# EAGLE design saturation.main (EAGLE 9.5.1)
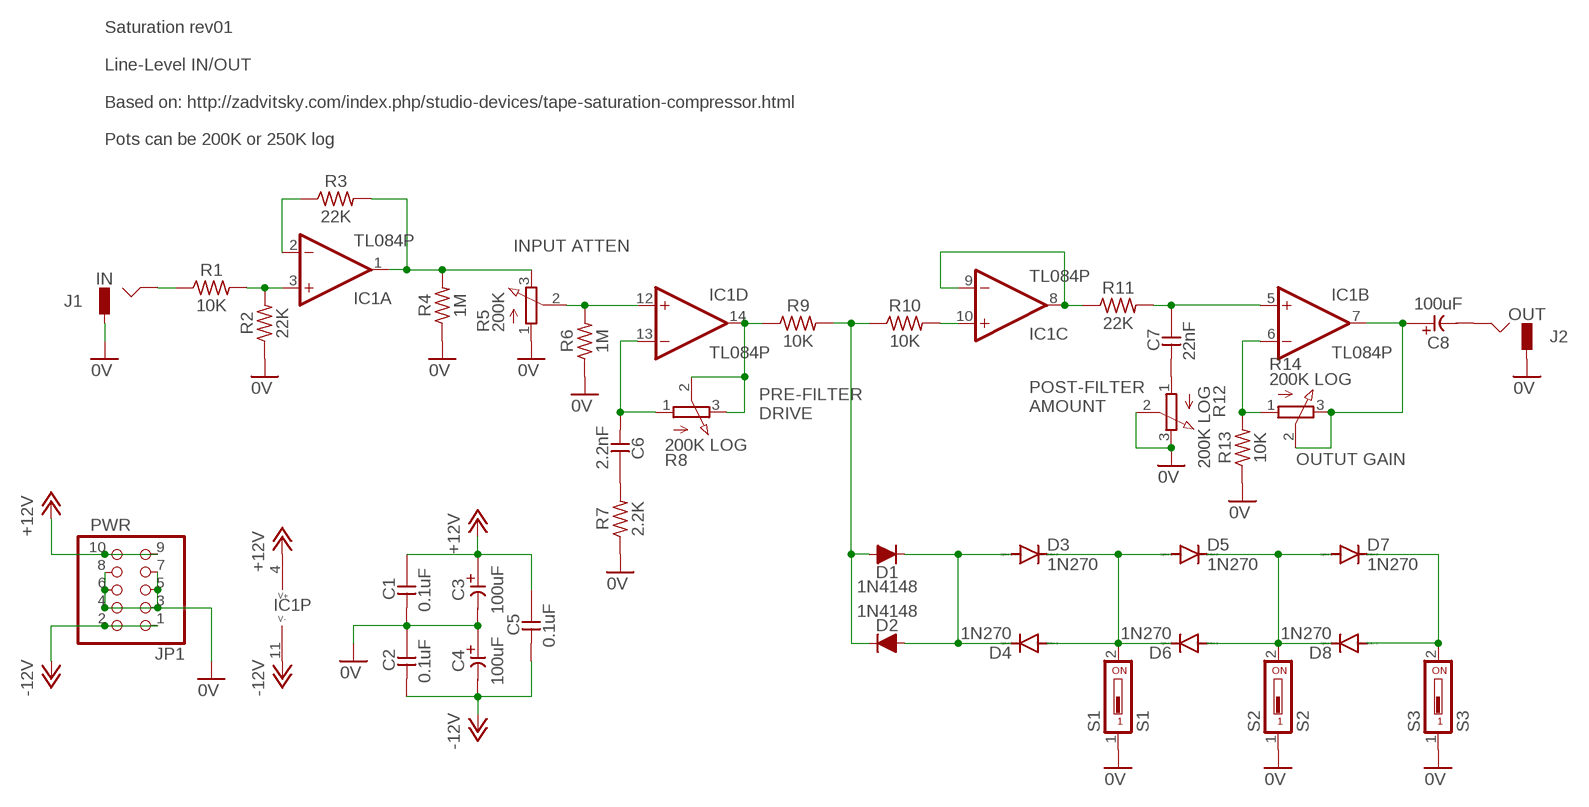
[diagram p0: schematic, sheet 1]

## Parts
C1  0.1uF  CC-US025-024X044  [C025-024X044]
C2  0.1uF  CC-US025-024X044  [C025-024X044]
C3  100uF  CE-USE5-8.5  [E5-8,5]
C4  100uF  CE-USE5-8.5  [E5-8,5]
C5  0.1uF  CC-US025-024X044  [C025-024X044]
C6  2.2nF  CC-US025-024X044  [C025-024X044]
C7  22nF  CC-US025-024X044  [C025-024X044]
C8  100uF  CE-USE5-8.5  [E5-8,5]
D1  1N4148  [DO34-5]
D2  1N4148  [DO34-5]
D3  1N270  [DO07]
D4  1N270  [DO07]
D5  1N270  [DO07]
D6  1N270  [DO07]
D7  1N270  [DO07]
D8  1N270  [DO07]
IC1  TL084P  [DIL14]
J1  IN  JACK-M  [JACK-M]
J2  OUT  JACK-M  [JACK-M]
JP1  PWR  PINHD-2X5  [2X05]
R1  10K  R  [0207/7]
R2  22K  R  [0207/7]
R3  22K  R  [0207/7]
R4  1M  R  [0207/7]
R5  200K  3RP/1610N  [3RP/1610N]
R6  1M  R  [0207/7]
R7  2.2K  R  [0207/7]
R8  200K LOG  3RP/1610N  [3RP/1610N]
R9  10K  R  [0207/7]
R10  10K  R  [0207/7]
R11  22K  R  [0207/7]
R12  200K LOG  3RP/1610N  [3RP/1610N]
R13  10K  R  [0207/7]
R14  200K LOG  3RP/1610N  [3RP/1610N]
S1  S1  DS01  [DS-01]
S2  S2  DS01  [DS-01]
S3  S3  DS01  [DS-01]

## Nets
0V [power]: C1.2 C2.1 C3.- C4.+ J1.GND J2.GND JP1.3 JP1.4 JP1.5 JP1.6 JP1.7 JP1.8 R2.1 R4.1 R5.1(A) R6.1 R7.1 R12.2(S) R12.3(E) R13.1 S1.1 S2.1 S3.1
+12V [power]: C1.1 C3.+ C5.1 IC1.4(P:V+) JP1.9 JP1.10
-12V [power]: C2.2 C4.- C5.2 IC1.11(P:V-) JP1.1 JP1.2
N$1: D1.A D2.C R9.2 R10.1
N$2: C7.2 R12.1(A)
N$3: D1.C D2.A D3.A D4.C
N$4: D3.C D4.A D5.A D6.C S1.2
N$5: IC1.10(C:+IN) R10.2
N$6: D5.C D6.A D7.A D8.C S2.2
N$7: IC1.8(C:OUT) IC1.9(C:-IN) R11.1
N$8: D7.C D8.A S3.2
N$9: C7.1 IC1.5(B:+IN) R11.2
N$10: IC1.6(B:-IN) R13.2 R14.1(A)
N$11: C8.+ IC1.7(B:OUT) R14.2(S) R14.3(E)
N$12: C8.- J2.HOT
N$14: IC1.14(D:OUT) R8.2(S) R8.3(E) R9.1
N$15: C6.1 R7.2
N$16: J1.HOT R1.1
N$17: IC1.3(A:+IN) R1.2 R2.2
N$18: IC1.2(A:-IN) R3.1
N$19: IC1.1(A:OUT) R3.2 R4.2 R5.3(E)
N$20: C6.2 IC1.13(D:-IN) R8.1(A)
N$21: IC1.12(D:+IN) R5.2(S) R6.2

## Notes on the sheet
- Saturation rev01
  
  Line-Level IN/OUT
  
  Based on: http://zadvitsky.com/index.php/studio-devices/tape-saturation-compressor.html
  
  Pots can be 200K or 250K log
- INPUT ATTEN
- POST-FILTER
  AMOUNT
- PRE-FILTER
  DRIVE
- OUTUT GAIN

## Library data of the parts
C1 C2 C5-C7 = _common:CC-US: CAPACITOR, US symbol
C3 C4 C8 = _common:CE-US: ELECTROLYTIC CAPACITOR, US symbol
D1 D2 = _common:1N4148: DIODE high speed (Philips)
D3-D8 = _common:1N270: DIODE germanium signal diode 100 V 325 mA Newark <https://canada.newark.com/solid-state/1n270/rf-diode-pin-0-8pf-100v-do-7/dp/10P4366>
IC1 = _common:TL084: OP AMP
J1 J2 = _common:JACK-M
JP1 = pinhead:PINHD-2X5: PIN HEADER
R1-R4 R6 R7 R9-R11 R13 = _common:R: RESISTOR, US symbol
R5 R8 R12 R14 = _common:3RP/1610N: Generic single level pcb pot.
S1-S3 = switch-dil:DS01: DIL/CODE SWITCH; OC_FARNELL: unknown; OC_NEWARK: unknown

## Net classes
0 default: width 0.406 mm
1 power: width 0.813 mm

## Board
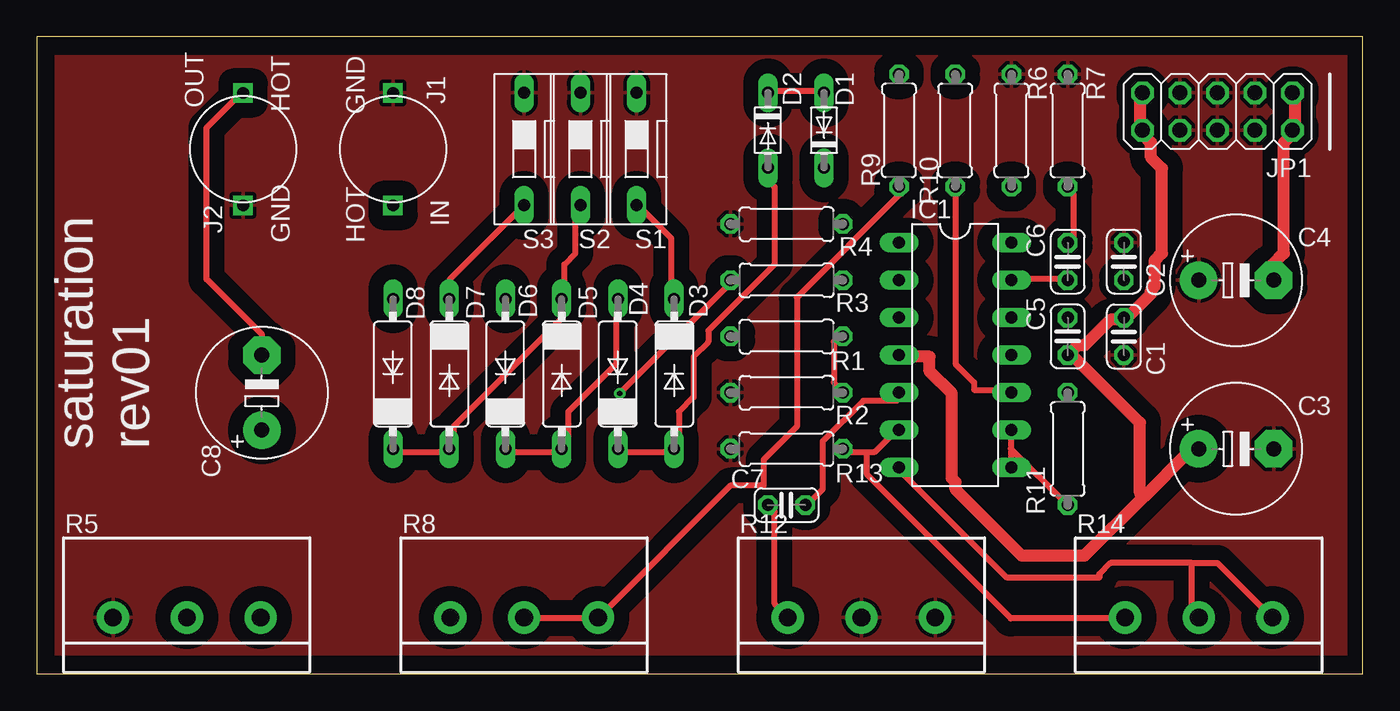
[diagram p1: board, top side]
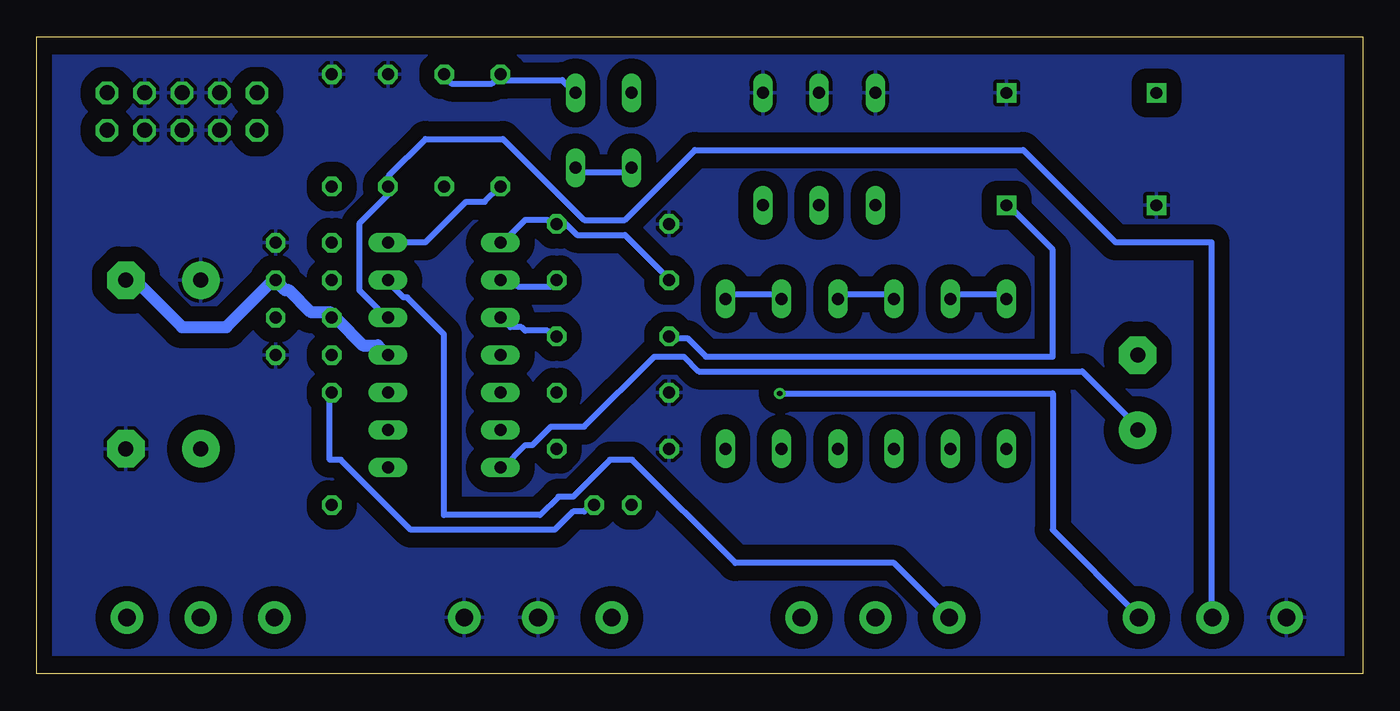
[diagram p2: board, bottom side, seen from below]

Size 89.84 x 43.17 mm. Coordinates in mm from the lower left corner, seen from the top.
Outline: 0,0 89.84,0 89.84,43.17 0,43.17 0,0
Copper layers (1*16): Top 0.035mm / dielectric 1.5mm / Bottom 0.035mm
Design rules "default": minimum track width 6mil, minimum drill 0.35mm, track to track 6mil, track to pad 6mil, pad to pad 6mil, via to via 6mil, smd to smd 6mil, copper to edge 40mil, drill to drill 6mil, minimum pad ring 10mil, minimum via ring 8mil, stop-mask expansion 4mil, vias tented up to drill 0mil, thermal gap 10mil

### Footprints (pad centres in the part's own frame; a part is rotated, then mirrored left to right if it is on the bottom)
C025-024X044 = drill 0.813 octagon: 1 -1.27,0; 2 1.27,0
E5-8,5 = drill 1.016 pad 2.54: + -2.54,0 | drill 1.016 pad 2.54 octagon: - 2.54,0
DO34-5 = drill 0.813 long: A 2.54,0; C -2.54,0
DO07 = drill 0.813 long: A 5.08,0; C -5.08,0
DIL14 = drill 0.813 long: 1 -7.62,-3.81; 2 -5.08,-3.81; 3 -2.54,-3.81; 4 0,-3.81; 5 2.54,-3.81; 6 5.08,-3.81; 7 7.62,-3.81; 8 7.62,3.81; 9 5.08,3.81; 10 2.54,3.81; 11 0,3.81; 12 -2.54,3.81; 13 -5.08,3.81; 14 -7.62,3.81
JACK-M = drill 0.8 square: GND -3.81,0; HOT 3.81,0
2X05 = drill 1.016 octagon: 1 -5.08,-1.27; 2 -5.08,1.27; 3 -2.54,-1.27; 4 -2.54,1.27; 5 0,-1.27; 6 0,1.27; 7 2.54,-1.27; 8 2.54,1.27; 9 5.08,-1.27; 10 5.08,1.27
0207/7 = drill 0.813 octagon: 1 -3.81,0; 2 3.81,0
3RP/1610N = drill 1.2 pad 2.184: 1 -5,0; 2 0,0; 3 5,0
DS-01 = drill 0.813 long: 1 0,-3.81; 2 0,3.81

### Placement (x,y rotation side)
C1  73.66,22.86 270 top
C2  73.66,27.94 270 top
C3  81.28,15.24 0 top
C4  81.28,26.67 0 top
C5  69.85,22.86 90 top
C6  69.85,27.94 270 top
C7  50.8,11.43 180 top
C8  15.24,19.05 90 top
D1  53.34,36.83 90 top
D2  49.53,36.83 270 top
D3  43.18,20.32 270 top
D4  39.37,20.32 90 top
D5  35.56,20.32 270 top
D6  31.75,20.32 90 top
D7  27.94,20.32 270 top
D8  24.13,20.32 90 top
IC1  62.23,21.59 270 top
J1  24.13,35.56 270 top
J2  13.97,35.56 90 top
JP1  80.01,38.1 180 top
R1  50.8,22.86 0 top
R2  50.8,19.05 0 top
R3  50.8,26.67 180 top
R4  50.8,30.48 0 top
R5  10.16,3.81 0 top
R6  66.04,36.83 270 top
R7  69.85,36.83 270 top
R8  33.02,3.81 0 top
R9  58.42,36.83 90 top
R10  62.23,36.83 270 top
R11  69.85,15.24 90 top
R12  55.88,3.81 0 top
R13  50.8,15.24 0 top
R14  78.74,3.81 0 top
S1  40.64,35.56 180 top
S2  36.83,35.56 180 top
S3  33.02,35.56 180 top

### Tracks (layer width: path | path; a pad name or v marks a point on that pad's centre or on a via)
0V
  pour Top (isolate 1.016): 1.27,41.91 88.9,41.91 88.9,1.27 1.27,1.27
  pour Bottom (isolate 1.016): 1.27,41.91 88.9,41.91 88.9,2.54 88.9,1.27 1.27,1.27
+12V
  Top 0.813: JP1.9 75,39.25 75,39 74.75,38.75 74.75,37 JP1.10 75,36.5 75.5,36 75.5,35 76.25,34.25 76.25,28.5 75.75,28 75.75,26.25 75.5,26 75.5,25.75 74,24.25 C1.1 73.5,24 72.75,24 71,22.25 70.5,22.25 70,21.75 C5.1 70.25,21.5 74.75,17 74.75,12.25 75,12 | 75,12 78,15 78.5,15 C3.+ | 75,12 71,8 66.75,8 62.25,12.5 62.25,13 62,13.25 62,19 60.5,20.5 60.5,21.5 58.5,21.5 IC1.4
-12V
  Top 0.813: JP1.1 85,39.25 85,39 85.25,38.75 85.25,37 JP1.2 85,36.5 84.5,36 84.5,28.5 83.75,27.75 83.75,26.75 C4.-
  Bottom 0.813: IC1.11 66.25,21.75 66.75,22.25 67.75,22.25 69.5,24 69.75,24 C5.2 70,24.5 71.25,24.5 72.75,26 73,26 73.5,26.5 C2.2 74,26.5 77,23.5 80,23.5 83,26.5 83.75,26.5 C4.-
N$1
  Top 0.406: D2.C 49.75,39.5 53.25,39.5 D1.A
  Bottom 0.406: R10.1 62.25,40.5 61.75,40 59,40 58.5,40.5 R9.2 58.5,40.25 54.25,40.25 53.5,39.5 D1.A
N$2
  Top 0.406: C7.2 49.75,11.25 50,11 50,4.75 50.75,4 R12.1
N$3
  Top 0.406: D4.C 39.5,15 43,15 D3.A 43.25,15.25 43.5,15.5 43.5,17.75 44.5,18.75 44.5,21.5 45.5,22.5 45.5,23.25 50,27.75 50,33 49.75,33.25 49.75,34.25 D2.A
  Bottom 0.406: D2.A 49.75,34.25 50,34 53,34 53.25,34.25 D1.C
N$4
  Top 0.406: D6.C 31.75,15 35.5,15 D5.A 35.75,15.25 36,15.5 36,17.75 39.25,21 39.25,25.25 D4.A | S1.2 40.75,31.75 43,29.5 43,25.5 D3.C
  Bottom 0.406: D4.A 39.5,25.5 39.75,25.75 42.75,25.75 43,25.5 D3.C
N$5
  Top 0.406: IC1.10 66,19.25 63.5,19.25 63.5,19.75 62.25,21 62.25,33 R10.2
N$6
  Top 0.406: D8.C 24.25,15 27.75,15 D7.A 28,15.25 28.25,15.5 28.25,16.75 35.5,24 35.5,25.25 D5.C 35.75,25.5 35.75,27.75 36.5,28.5 36.5,31.5 36.75,31.75 S2.2
  Bottom 0.406: D6.A 31.75,25.5 32,25.75 35.25,25.75 35.5,25.5 D5.C
N$7
  Top 0.406: 66,15.25 66,16.5 IC1.9 | 66,15.25 66,14 IC1.8 | 66,15.25 69.75,11.5 R11.1
N$8
  Top 0.406: S3.2 33,31.75 28,26.75 28,25.5 D7.C
  Bottom 0.406: D8.A 24.25,25.5 24.5,25.75 27.5,25.75 27.75,25.5 D7.C
N$9
  Top 0.406: C7.1 52.25,11.5 53.25,12.5 53.25,15.75 56,18.5 58.25,18.5 58.25,19 IC1.5
  Bottom 0.406: R11.2 70,19 70,14.5 69.25,14.5 64.5,9.75 54.75,9.75 53.5,11 52.75,11 52.5,11.25 52.25,11.25 C7.1
N$10
  Top 0.406: 56.25,15 56.75,15 58.25,16.5 IC1.6 | 56.25,15 54.75,15 R13.2 | 56.25,15 56.25,13.5 66,3.75 73.5,3.75 R14.1
N$11
  Top 0.406: 78.25,7.5 72.75,7.5 72,6.75 72,6.5 65.75,6.5 58.5,13.75 IC1.7 | 78.25,7.5 78.25,4.25 78.5,4 R14.2 | 78.25,7.5 80,7.5 83.5,4 R14.3
  Bottom 0.406: C8.+ 15.25,16.75 19,20.5 45,20.5 46,21.5 48,21.5 52.75,16.75 55,16.75 56.25,15.5 56.75,15.5 58.25,14 IC1.7
N$12
  Top 0.406: J2.HOT 13.75,39.25 11.5,37 11.5,26.75 15.25,23 15.25,21.75 C8.-
N$14
  Top 0.406: R8.2 33.25,3.75 38,3.75 R8.3 38.25,4 47,12.75 49.25,12.75 49.25,14.5 51.5,16.75 51.5,25.5 58.5,32.5 58.5,33 R9.1
  Bottom 0.406: R9.1 58.5,33 59.5,32 60.75,32 63.5,29.25 66,29.25 IC1.14
N$15
  Top 0.406: C6.1 70,29.25 70.25,29.5 70.25,32.5 70,32.75 70,33 R7.2
N$16
  Bottom 0.406: J1.HOT 24,31.75 21,28.75 21,21.5 44.5,21.5 45.75,22.75 46.75,22.75 R1.1
N$17
  Top 0.406: R2.2 54.5,19.25 54,19.75 54,22.5 54.5,23 R1.2
  Bottom 0.406: IC1.3 58.25,24 57.75,23.5 57,23.5 56.75,23.25 55.25,23.25 55,23 54.75,23 R1.2
N$18
  Bottom 0.406: R3.1 54.75,26.5 55,26.25 57.25,26.25 57.5,26.5 58.25,26.5 IC1.2
N$19  (via drill 0.35)
  Top 0.406: v39.5,19 46.75,26.25 46.75,26.5 R3.2
  Bottom 0.406: R3.2 47,26.75 50,29.75 53.25,29.75 54,30.5 54.5,30.5 R4.2 54.75,30.5 55,30.5 55.25,30.75 56.75,30.75 58.25,29.25 IC1.1 | v39.5,19 21,19 21,9.75 15.25,4 R5.3
N$20
  Top 0.406: IC1.13 66.25,26.75 69.75,26.75 C6.2
  Bottom 0.406: IC1.13 66,26.5 65,25.5 64.75,25.5 62.25,23 62.25,10.75 55.75,10.75 54.5,12 53.5,12 51,14.5 49.5,14.5 42.5,7.5 31.75,7.5 28.25,4 R8.1
N$21
  Bottom 0.406: IC1.12 66.25,24.25 68,26 68,30.5 66,32.5 66,33 R6.2 66,33.25 66,33.75 63.5,36.25 58.25,36.25 52.75,30.75 50,30.75 45.25,35.5 23,35.5 16.75,29.25 10.25,29.25 10.25,4 R5.2

### Text on the board
tNames: saturation / rev01